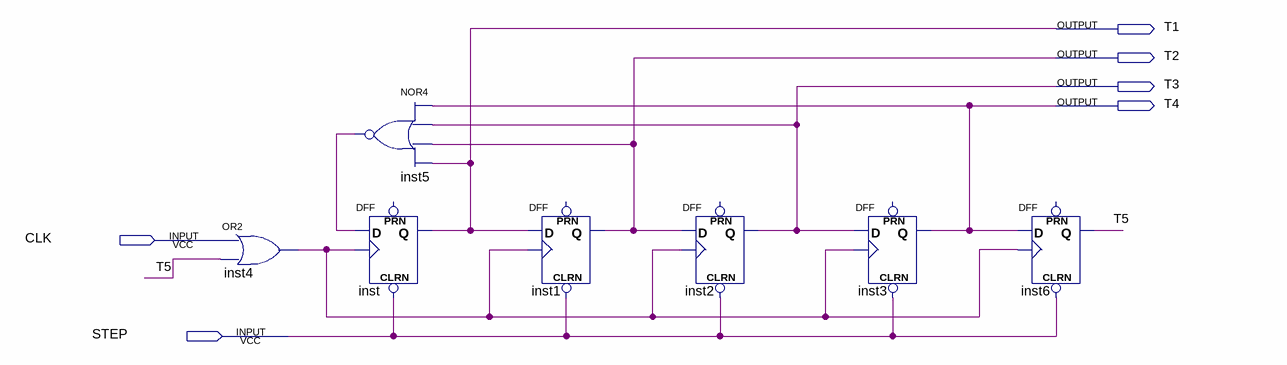
[diagram p0: schematic sheet]
// Quartus schematic STEP.bdf as structural Verilog: 7 symbols, 6 pins
module STEP (
  input  CLK,
  input  STEP,
  output T1,
  output T2,
  output T3,
  output T4
);

  wire inst4_out, inst5_out, T5;

  or inst4 (inst4_out, CLK, T5);
  nor inst5 (inst5_out, T4, T3, T2, T1);
  DFF inst (.CLRN(STEP), .CLK(inst4_out), .D(inst5_out), .Q(T1));  // open: PRN
  DFF inst1 (.CLRN(STEP), .CLK(inst4_out), .D(T1), .Q(T2));  // open: PRN
  DFF inst2 (.CLRN(STEP), .CLK(inst4_out), .D(T2), .Q(T3));  // open: PRN
  DFF inst3 (.CLRN(STEP), .CLK(inst4_out), .D(T3), .Q(T4));  // open: PRN
  DFF inst6 (.CLRN(STEP), .CLK(inst4_out), .D(T4), .Q(T5));  // open: PRN
endmodule
